# Altium schematic sheet HV_Offset_block.SchDoc
size A4
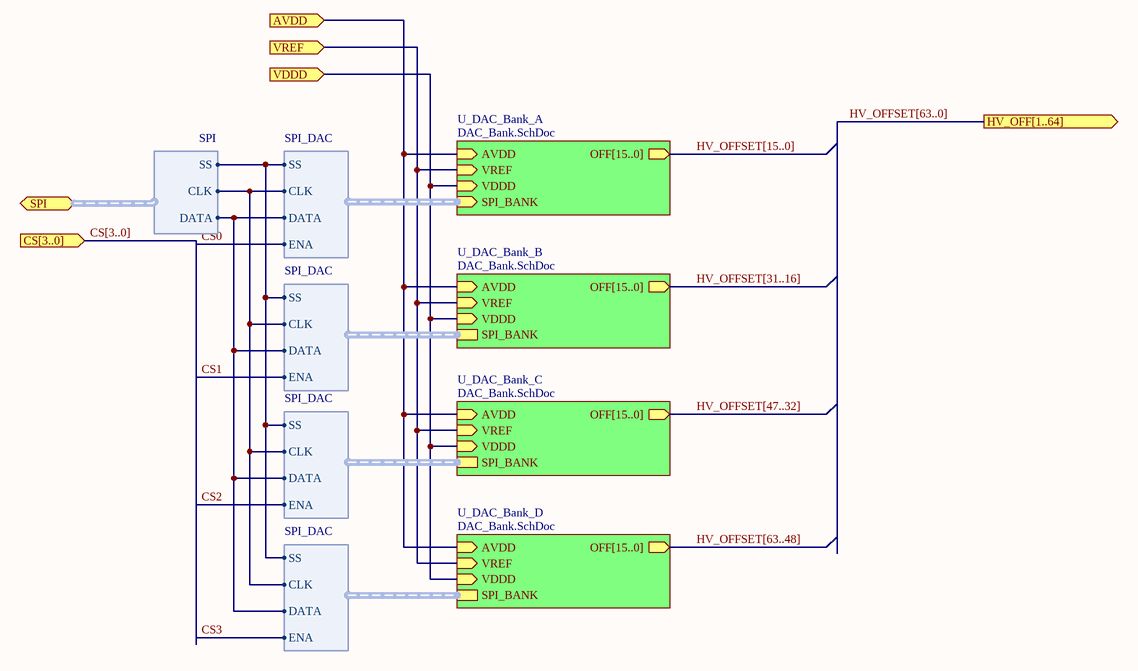
[diagram p0: HV_Offset_block.SchDoc]

## Sub-sheets
U_DAC_Bank_A = DAC_Bank.SchDoc: AVDD (in), VREF (in), VDDD (in), OFF[15..0] (out), SPI_BANK (in, harness SPI_DAC)
U_DAC_Bank_B = DAC_Bank.SchDoc: AVDD (in), VREF (in), VDDD (in), SPI_BANK (harness SPI_DAC), OFF[15..0] (out)
U_DAC_Bank_C = DAC_Bank.SchDoc: AVDD (in), VREF (in), VDDD (in), SPI_BANK (harness SPI_DAC), OFF[15..0] (out)
U_DAC_Bank_D = DAC_Bank.SchDoc: AVDD (in), VREF (in), VDDD (in), SPI_BANK (harness SPI_DAC), OFF[15..0] (out)

## Ports
AVDD (in), CS[3..0] (in), HV_OFF[1..64] (out), SPI (bidir, harness SPI), VDDD (in), VREF (in)

## Harnesses
SPI_DAC: DATA, CLK, SS, ENA
SPI: DATA, CLK, SS

## Nets
AVDD: port AVDD, sheet U_DAC_Bank_A/AVDD, sheet U_DAC_Bank_B/AVDD, sheet U_DAC_Bank_C/AVDD, sheet U_DAC_Bank_D/AVDD
CS0: sheet U_DAC_Bank_A/SPI_BANK.ENA
CS1: sheet U_DAC_Bank_B/SPI_BANK.ENA
CS2: sheet U_DAC_Bank_C/SPI_BANK.ENA
CS3: sheet U_DAC_Bank_D/SPI_BANK.ENA
VDDD: port VDDD, sheet U_DAC_Bank_A/VDDD, sheet U_DAC_Bank_B/VDDD, sheet U_DAC_Bank_C/VDDD, sheet U_DAC_Bank_D/VDDD
VREF: port VREF, sheet U_DAC_Bank_A/VREF, sheet U_DAC_Bank_B/VREF, sheet U_DAC_Bank_C/VREF, sheet U_DAC_Bank_D/VREF
(unnamed): sheet U_DAC_Bank_A/SPI_BANK.DATA, port SPI.DATA, sheet U_DAC_Bank_B/SPI_BANK.DATA, sheet U_DAC_Bank_C/SPI_BANK.DATA, sheet U_DAC_Bank_D/SPI_BANK.DATA
(unnamed): sheet U_DAC_Bank_A/SPI_BANK.CLK, port SPI.CLK, sheet U_DAC_Bank_B/SPI_BANK.CLK, sheet U_DAC_Bank_C/SPI_BANK.CLK, sheet U_DAC_Bank_D/SPI_BANK.CLK
(unnamed): sheet U_DAC_Bank_A/SPI_BANK.SS, port SPI.SS, sheet U_DAC_Bank_B/SPI_BANK.SS, sheet U_DAC_Bank_C/SPI_BANK.SS, sheet U_DAC_Bank_D/SPI_BANK.SS

## Buses and harness runs
bus CS[3..0] = port CS[3..0]
bus HV_OFFSET[15..0] = sheet U_DAC_Bank_A/OFF[15..0]
bus HV_OFFSET[31..16] = sheet U_DAC_Bank_B/OFF[15..0]
bus HV_OFFSET[47..32] = sheet U_DAC_Bank_C/OFF[15..0]
bus HV_OFFSET[63..0] = port HV_OFF[1..64]
bus HV_OFFSET[63..48] = sheet U_DAC_Bank_D/OFF[15..0]